# EAGLE design Carte USB (EAGLE 7.2.0)
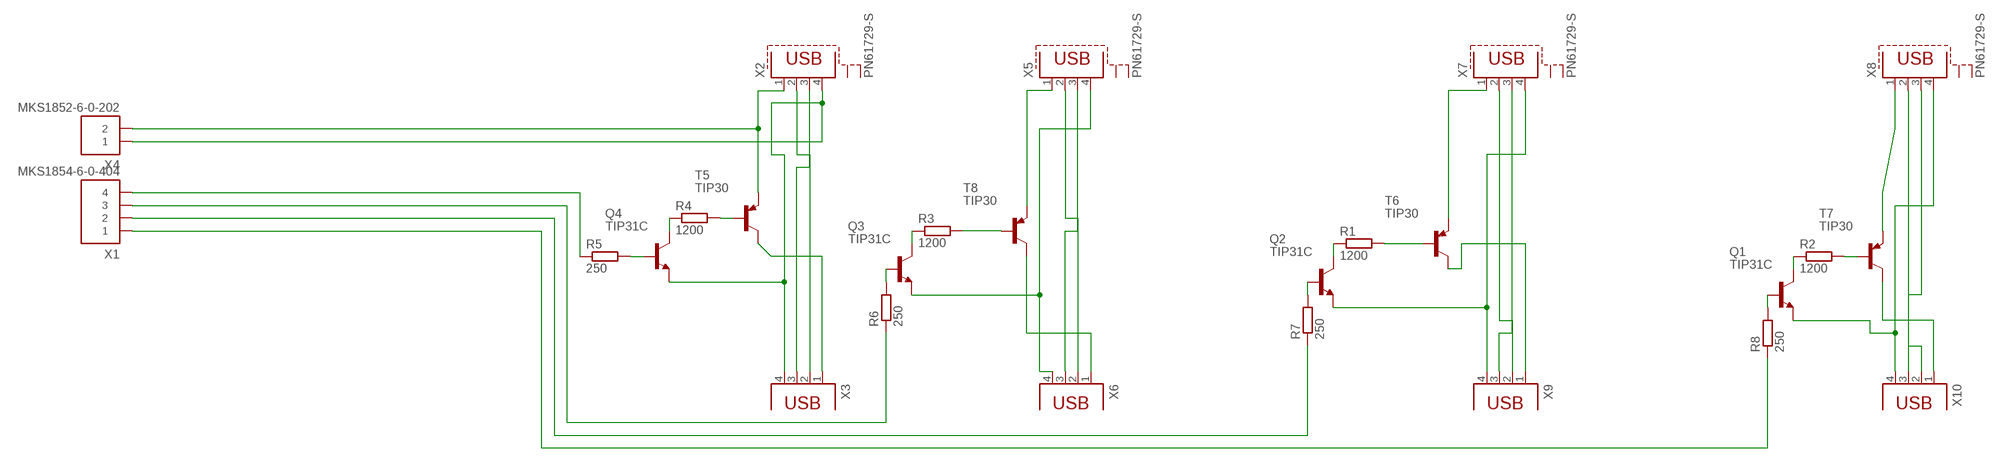
[diagram p0: schematic, sheet 1]

## Parts
Q1  TIP31C  [TO220]
Q2  TIP31C  [TO220]
Q3  TIP31C  [TO220]
Q4  TIP31C  [TO220]
R1  1200  R-EU_0207/10  [0207/10]
R2  1200  R-EU_0207/10  [0207/10]
R3  1200  R-EU_0207/10  [0207/10]
R4  1200  R-EU_0207/10  [0207/10]
R5  250  R-EU_0207/10  [0207/10]
R6  250  R-EU_0207/12  [0207/12]
R7  250  R-EU_0207/10  [0207/10]
R8  250  R-EU_0207/10  [0207/10]
T5  TIP30  [TO220]
T6  TIP30  [TO220]
T7  TIP30  [TO220]
T8  TIP30  [TO220]
X1  MKS1854-6-0-404  [MKS1854-6-0-404]
X2  PN61729-S  [PN61729-S]
X3  PN87520  [PN87520]
X4  MKS1852-6-0-202  [MKS1852-6-0-202]
X5  PN61729-S  [PN61729-S]
X6  PN87520  [PN87520]
X7  PN61729-S  [PN61729-S]
X8  PN61729-S  [PN61729-S]
X9  PN87520  [PN87520]
X10  PN87520  [PN87520]

## Nets
N$1: R4.2 T5.1(B)
N$2: R3.2 T8.1(B)
N$4: X2.2 X3.2
N$5: R1.2 T6.1(B)
N$6: R2.2 T7.1(B)
N$7: X2.3 X3.3
N$8: X5.3 X6.3
N$9: T8.2(C) X6.1
N$10: X5.2 X6.2
N$11: Q4.2(C) R4.1
N$12: X7.2 X9.2
N$13: Q4.3(E) X2.4 X3.4 X4.1
N$14: X7.3 X9.3
N$15: T6.3(E) X7.1
N$16: X8.2 X10.2
N$17: X8.3 X10.3
N$18: Q1.3(E) X8.4 X10.4
N$19: Q3.3(E) X5.4 X6.4
N$20: T6.2(C) X9.1
N$21: T7.2(C) X10.1
N$22: Q2.3(E) X7.4 X9.4
N$23: Q3.2(C) R3.1
N$24: Q2.2(C) R1.1
N$25: T5.2(C) X3.1
N$26: Q1.2(C) R2.1
N$27: R8.1 X1.1
N$28: Q4.1(B) R5.2
N$29: Q3.1(B) R6.2
N$30: Q2.1(B) R7.2
N$31: R7.1 X1.2
N$32: R6.1 X1.3
N$33: R5.1 X1.4
N$34: Q1.1(B) R8.2
N$36: T5.3(E) X2.1 X4.2
N$37: T8.3(E) X5.1
N$38: T7.3(E) X8.1
Unconnected: X2.S1 X2.S2 X5.S1 X5.S2 X7.S1 X7.S2 X8.S1 X8.S2

## Library data of the parts
Q1-Q4 = transistor-npn:TIP31C*: NPN Transistor
R1-R8 = rcl:R-EU_: RESISTOR, European symbol
T5-T8 = transistor-pnp:TIP30: PNP Transistor
X1 = con-stocko:MKS1854-6-0-404: Serie MKS 1850 Lötstifte In-line, Raster 2.5 mm, Stiftwannen, stehend, mit Rastlasche Source: http://www.stocko.de/de/index.php?seite=ka_rfk2_mks1850.html&rubrik=Katalog+-+RFK+2 rfk_1850.pdf; OC_FARNELL: 1141862; OC_NEWARK: unknown
X2 X5 X7 X8 = con-berg:PN61729-S: BERG USB connector; OC_FARNELL: unknown; OC_NEWARK: unknown
X3 X6 X9 X10 = con-berg:PN87520: BERG USB connector; OC_FARNELL: unknown; OC_NEWARK: unknown
X4 = con-stocko:MKS1852-6-0-202: Serie MKS 1850 Lötstifte In-line, Raster 2.5 mm, Stiftwannen, stehend, mit Rastlasche Source: http://www.stocko.de/de/index.php?seite=ka_rfk2_mks1850.html&rubrik=Katalog+-+RFK+2 rfk_1850.pdf; OC_FARNELL: unknown; OC_NEWARK: unknown

## Net classes
0 default: width 1 mm

## Board
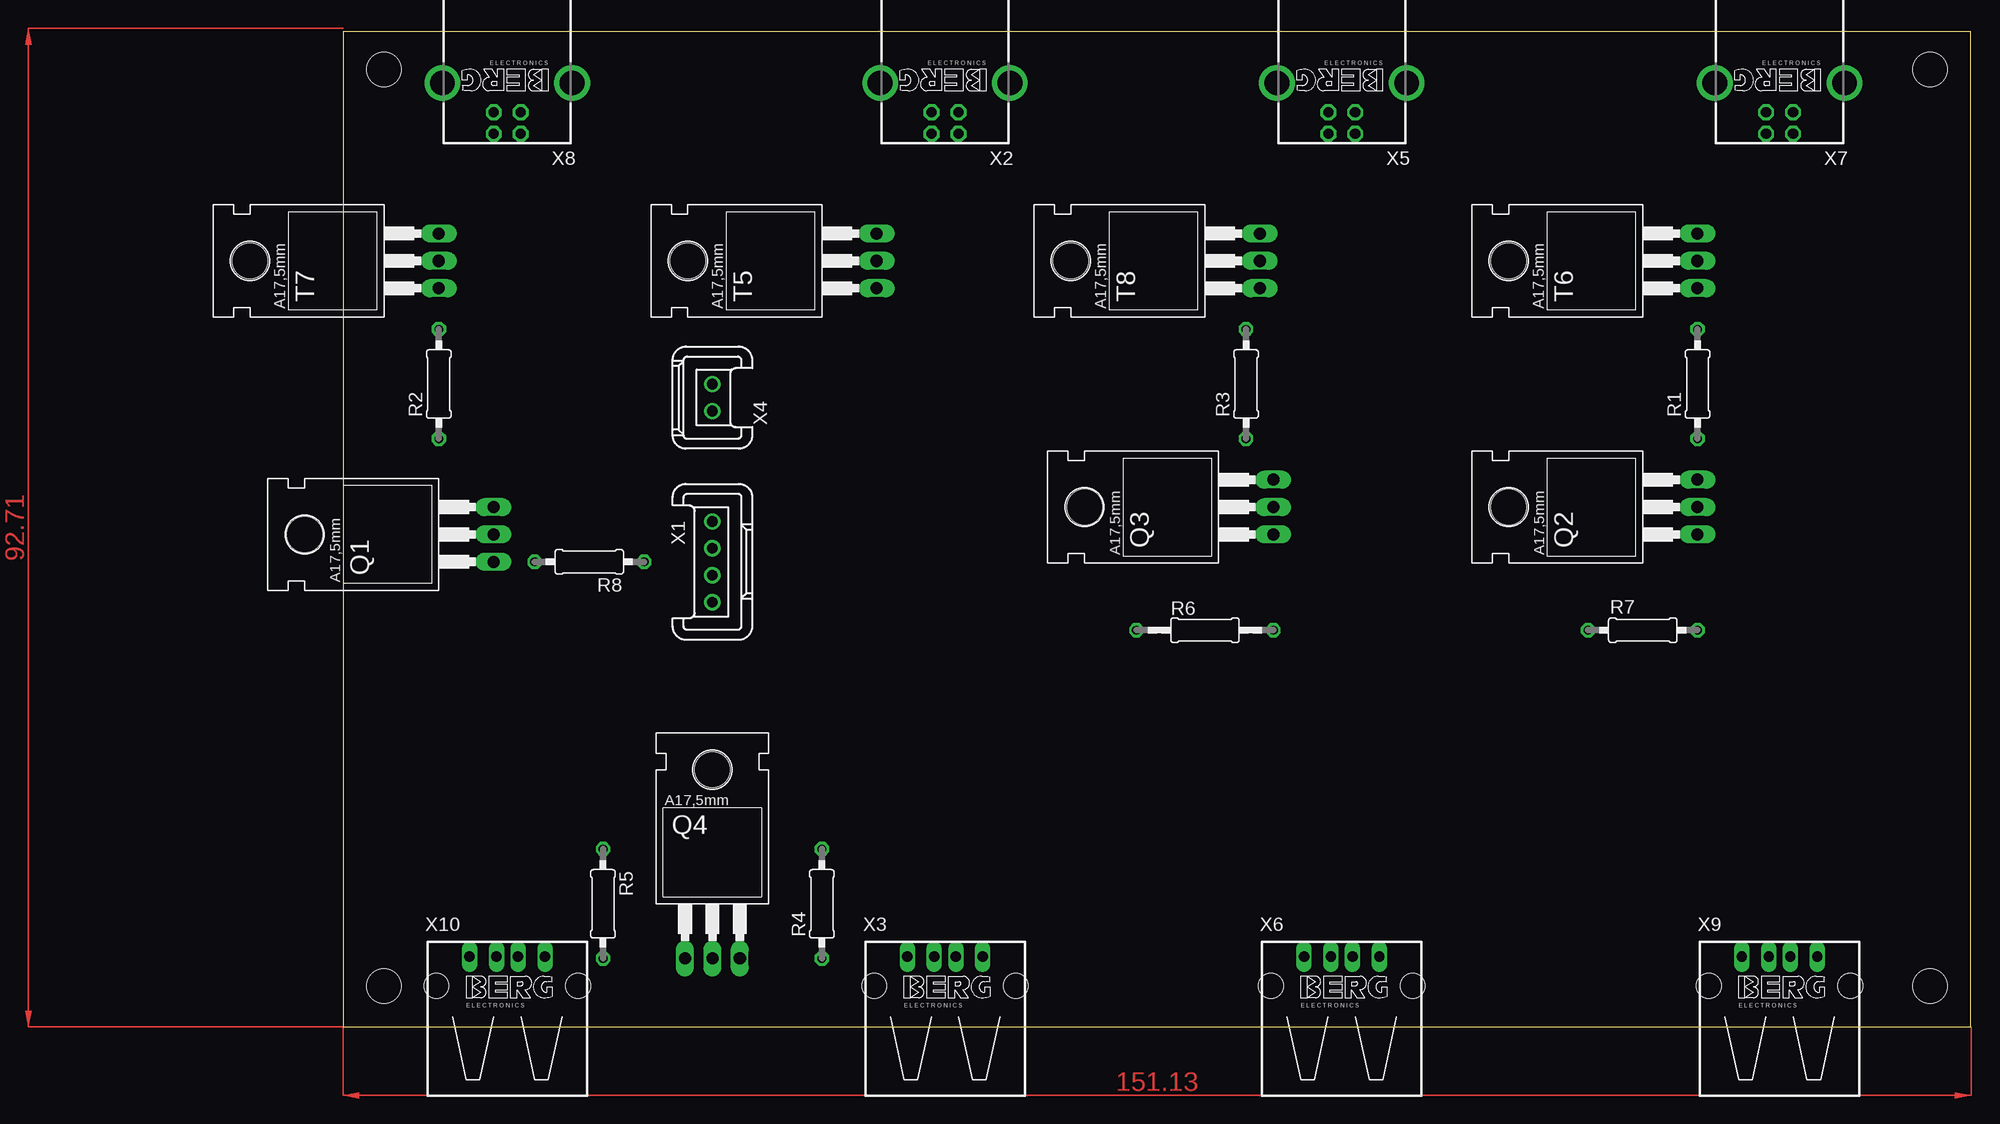
[diagram p1: board, top side]
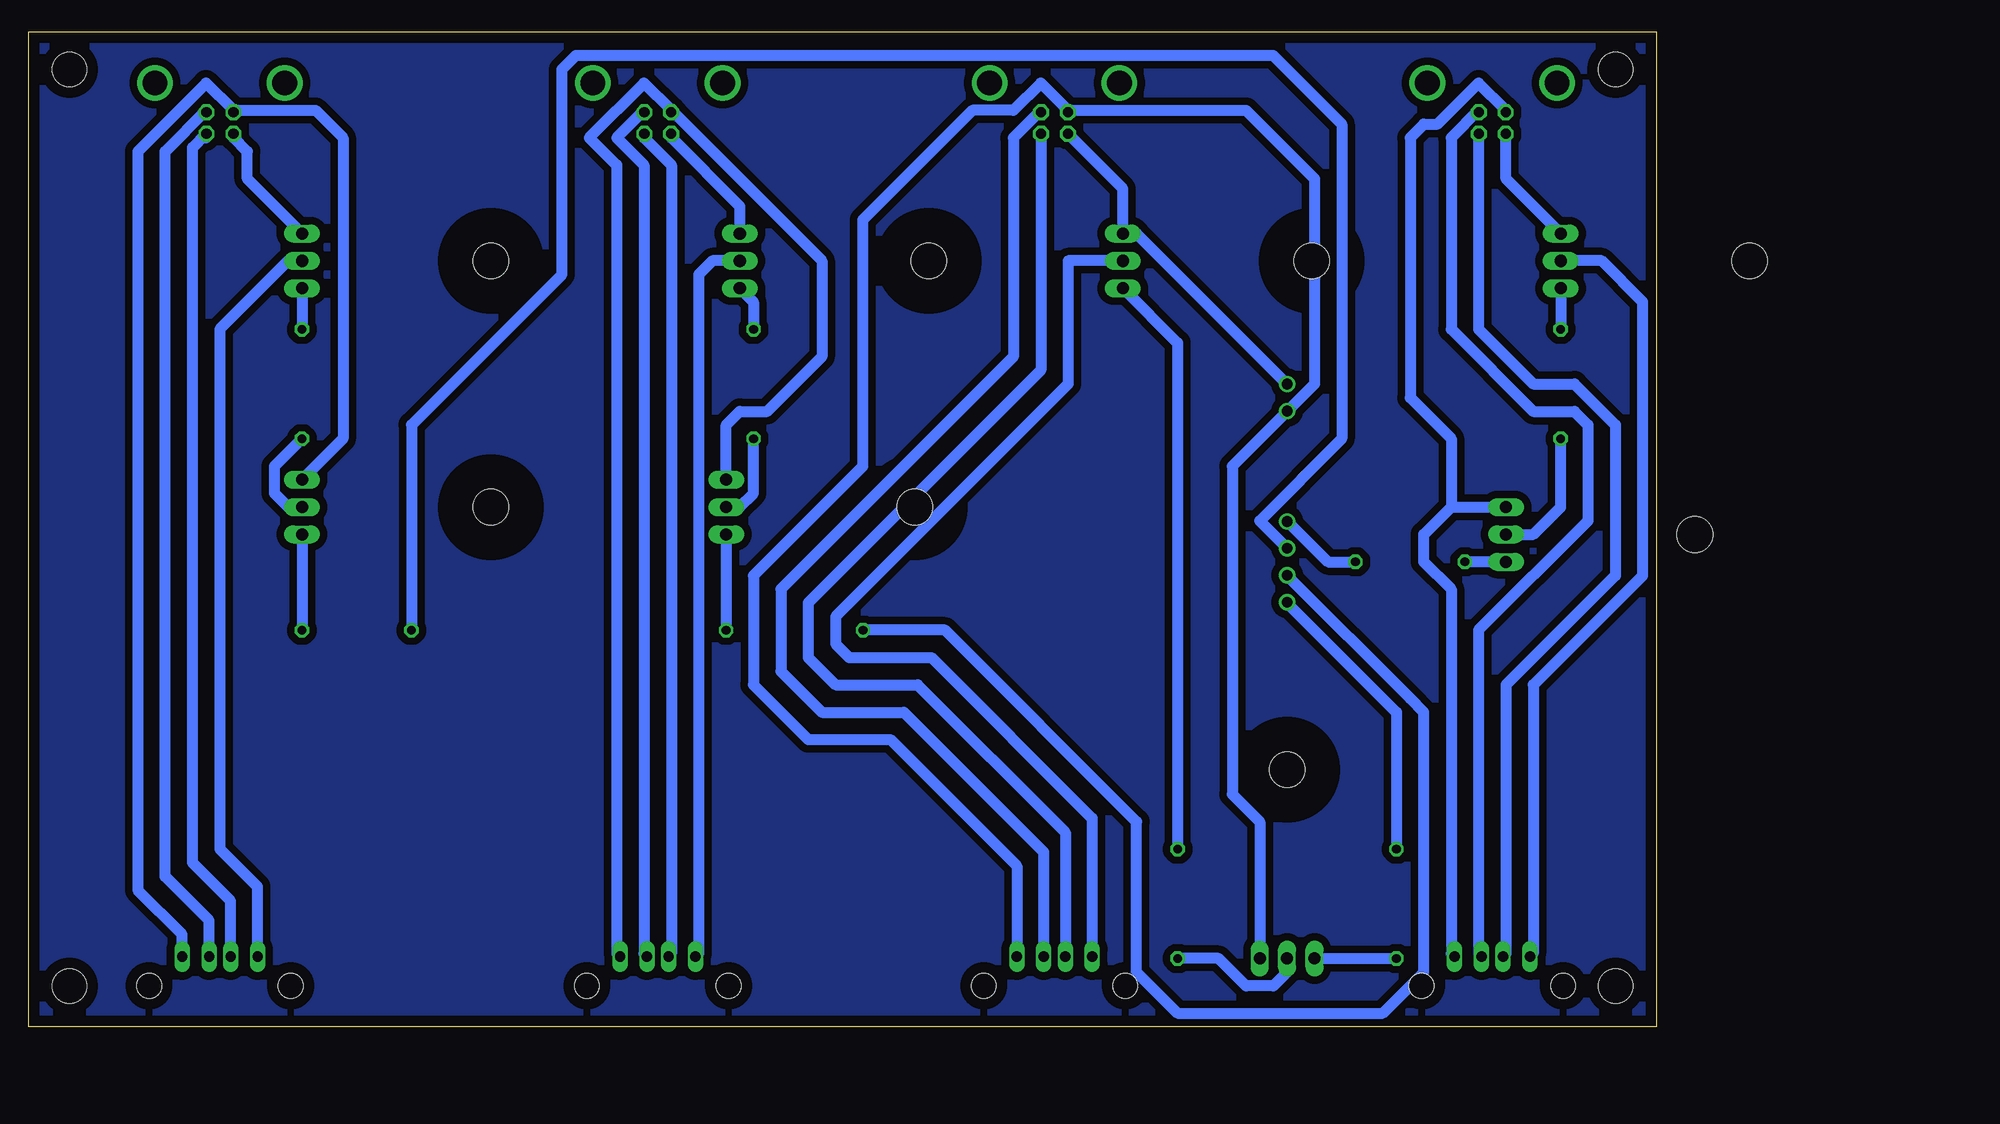
[diagram p2: board, bottom side, seen from below]

Size 151.11 x 92.38 mm. Coordinates in mm from the lower left corner, seen from the top.
Outline: 0,0 151.11,0 151.11,92.38 0,92.38 0,0
Copper layers (1*16): Top 0.035mm / dielectric 1.5mm / Bottom 0.035mm
Design rules "default": minimum track width 10mil, minimum drill 24mil, track to track 8mil, track to pad 8mil, pad to pad 8mil, via to via 8mil, smd to smd 8mil, copper to edge 40mil, drill to drill 8mil, minimum pad ring 10mil, minimum via ring 8mil, stop-mask expansion 4mil, vias tented up to drill 0mil, thermal gap 10mil
Holes 3.2 mm at 3.81,88.9 3.81,3.81 147.32,88.9 147.32,3.81

### Footprints (pad centres in the part's own frame; a part is rotated, then mirrored left to right if it is on the bottom)
TO220 = drill 1.118 long: 1 -2.54,-6.35; 2 0,-6.35; 3 2.54,-6.35 | hole 3.302: 0,11.176
0207/10 = drill 0.813 octagon: 1 -5.08,0; 2 5.08,0
0207/12 = drill 0.813 octagon: 1 -6.35,0; 2 6.35,0
MKS1854-6-0-404 = drill 1 pad 1.422: 1 -3.75,0; 2 -1.25,0; 3 1.25,0; 4 3.75,0
PN61729-S = drill 0.95 octagon: 1 1.25,4.71; 2 -1.25,4.71; 3 -1.25,2.71; 4 1.25,2.71 | drill 2.3 pad 2.9: S1 -6.02,0; S2 6.02,0
PN87520 = drill 0.95 long: 1 -3.5,2.71; 2 -1,2.71; 3 1,2.71; 4 3.5,2.71 | hole 2.3: -6.57,0; 6.57,0
MKS1852-6-0-202 = drill 1 pad 1.422: 1 -1.25,0; 2 1.25,0

### Placement (x,y rotation side)
Q1  7.62,45.72 90 top
Q2  119.38,48.26 90 top
Q3  80.01,48.26 90 top
Q4  34.29,12.7 0 top
R1  125.73,59.69 90 top
R2  8.89,59.69 90 top
R3  83.82,59.69 90 top
R4  44.45,11.43 90 top
R5  24.13,11.43 270 top
R6  80.01,36.83 0 top
R7  120.65,36.83 0 top
R8  22.86,43.18 180 top
T5  43.18,71.12 90 top
T6  119.38,71.12 90 top
T7  2.54,71.12 90 top
T8  78.74,71.12 90 top
X1  34.29,43.18 270 top
X2  55.88,87.63 180 top
X3  55.88,3.81 0 top
X4  34.29,58.42 90 top
X5  92.71,87.63 180 top
X6  92.71,3.81 0 top
X7  133.35,87.63 180 top
X8  15.24,87.63 180 top
X9  133.35,3.81 0 top
X10  15.24,3.81 0 top

### Tracks (layer width: path | path; a pad name or v marks a point on that pad's centre or on a via)
N$1
  Bottom 1: R4.2 44.45,63.5 T5.1
N$2
  Bottom 1: T8.1 83.82,67.31 R3.2
N$3
  Bottom 0.8: 2.54,3.81 3.81,3.81 | 5.08,3.81 3.81,3.81 | 3.81,3.81 3.81,5.08 | 3.81,3.81 3.81,2.54
N$4
  Bottom 1: X2.2 57.15,82.55 57.15,60.96 78.74,39.37 78.74,34.29 76.2,31.75 68.58,31.75 54.88,18.05 X3.2
N$5
  Bottom 1: T6.1 R1.2
N$6
  Bottom 1: T7.1 R2.2
N$7
  Bottom 1: X2.3 57.15,85.09 59.69,82.55 59.69,62.23 81.28,40.64 81.28,33.02 77.47,29.21 69.85,29.21 56.88,16.24 X3.3
N$8
  Bottom 1: X5.3 93.98,85.09 96.52,82.55 93.98,80.01 93.98,6.79 X6.3
N$9
  Bottom 1: T8.2 87.63,71.12 88.9,69.85 88.9,6.83 X6.1
N$10
  Bottom 1: X5.2 93.98,82.55 91.44,80.01 91.44,6.79 X6.2
N$11
  Bottom 1: R4.1 40.64,6.35 38.1,3.81 35.56,3.81 34.29,5.08 Q4.2
N$12
  Bottom 1: 134.62,82.55 X7.2 135.89,81.63 135.89,15.24 132.35,11.7 X9.2
N$13
  Bottom 1: 54.61,85.09 57.15,87.63 59.69,85.09 63.5,85.09 73.66,74.93 73.66,52.07 83.82,41.91 83.82,31.75 78.74,26.67 71.12,26.67 59.38,14.93 X3.4 | 34.29,57.15 31.75,59.69 31.75,78.74 38.1,85.09 54.61,85.09 | 54.61,85.09 X2.4 | Q4.3 36.83,19.05 39.37,21.59 39.37,52.07 34.29,57.15 | 34.29,57.15 X4.1
N$14
  Bottom 1: X7.3 134.62,85.09 138.43,81.28 138.43,13.97 134.35,9.89 X9.3
N$15
  Bottom 1: T6.3 130.81,78.74 130.81,81.28 132.08,82.55 X7.1
N$16
  Bottom 1: X8.2 16.51,82.55 16.51,64.77 11.43,59.69 7.62,59.69 3.81,55.88 3.81,41.91 13.97,31.75 13.97,6.79 X10.2
N$17
  Bottom 1: X8.3 16.51,85.09 19.05,82.55 19.05,64.77 11.43,57.15 7.62,57.15 6.35,55.88 6.35,46.99 16.51,36.83 16.51,6.79 X10.3
N$18
  Bottom 1: X8.4 13.97,85.09 16.51,87.63 20.32,83.82 21.59,83.82 22.86,82.55 22.86,58.42 19.05,54.61 19.05,48.26 | 19.05,48.26 21.59,45.72 21.59,43.18 19.05,40.64 19.05,6.83 X10.4 | 19.05,48.26 Q1.3
N$19
  Bottom 1: 91.44,85.09 93.98,87.63 99.06,82.55 96.52,80.01 96.52,6.83 X6.4 | 91.44,85.09 77.47,71.12 77.47,62.23 82.55,57.15 85.09,57.15 86.36,55.88 Q3.3 | 91.44,85.09 X5.4
N$20
  Bottom 1: T6.2 127,71.12 133.35,64.77 133.35,16.51 129.85,13.01 X9.1
N$21
  Bottom 1: T7.2 5.08,71.12 1.27,67.31 1.27,41.91 11.43,31.75 11.43,6.83 X10.1
N$22
  Bottom 1: 132.08,85.09 134.62,87.63 140.97,81.28 140.97,12.7 136.85,8.58 X9.4 | 132.08,85.09 X7.4 | 132.08,85.09 124.46,85.09 121.92,82.55 121.92,54.61 Q2.3
N$23
  Bottom 1: Q3.2 85.09,48.26 83.82,49.53 R3.1
N$24
  Bottom 1: R1.1 128.27,52.07 128.27,49.53 127,48.26 Q2.2
N$25
  Bottom 1: T5.2 54.61,71.12 54.61,59.69 76.2,38.1 76.2,35.56 74.93,34.29 67.31,34.29 52.38,19.36 X3.1
N$26
  Bottom 1: Q1.2 11.43,45.72 8.89,48.26 R2.1
N$27
  Bottom 1: R8.1 30.48,43.18 34.29,46.99 X1.1
N$28
  Bottom 1: Q4.1 R5.2
N$29
  Bottom 1: Q3.1 R6.2
N$30
  Bottom 1: Q2.1 R7.2
N$31
  Bottom 1: R7.1 115.57,55.88 101.6,69.85 101.6,88.9 100.33,90.17 35.56,90.17 29.21,83.82 29.21,54.61 36.83,46.99 34.29,44.45 X1.2
N$32
  Bottom 1: R6.1 66.04,36.83 48.26,19.05 48.26,5.08 44.45,1.27 25.4,1.27 21.59,5.08 21.59,29.21 22.86,30.48 22.86,30.5 X1.3 34.29,41.91
N$33
  Bottom 1: R5.1 24.13,29.21 34.29,39.37 X1.4
N$34
  Bottom 1: Q1.1 R8.2
N$35
  Bottom 0.8: 2.54,88.9 3.81,88.9 | 5.08,88.9 3.81,88.9 | 3.81,88.9 3.81,90.17 | 3.81,88.9 3.81,87.63
N$36
  Bottom 1: X4.2 34.29,59.69 48.26,73.66 T5.3 49.53,77.82 X2.1
N$37
  Bottom 1: X5.1 91.44,82.55 85.09,76.2 T8.3
N$38
  Bottom 1: T7.3 13.97,78.74 13.97,82.55 X8.1
N$39
  Bottom 0.8: 146.05,88.9 147.32,88.9 | 148.59,88.9 147.32,88.9 | 147.32,88.9 147.32,90.17 | 147.32,88.9 147.32,87.63
N$40
  Bottom 0.8: 146.05,3.81 147.32,3.81 | 148.59,3.81 147.32,3.81 | 147.32,3.81 147.32,5.08 | 147.32,3.81 147.32,2.54
N$41
  pour Bottom (isolate 0.7): 0,92.71 151.13,92.71 151.13,91.44 151.13,0 0,0
(copper drawn outside any net)
  shapes: Top area x2